# Altium schematic sheet STM32G0B1CEU6.SchDoc
size A3; Revision: 10
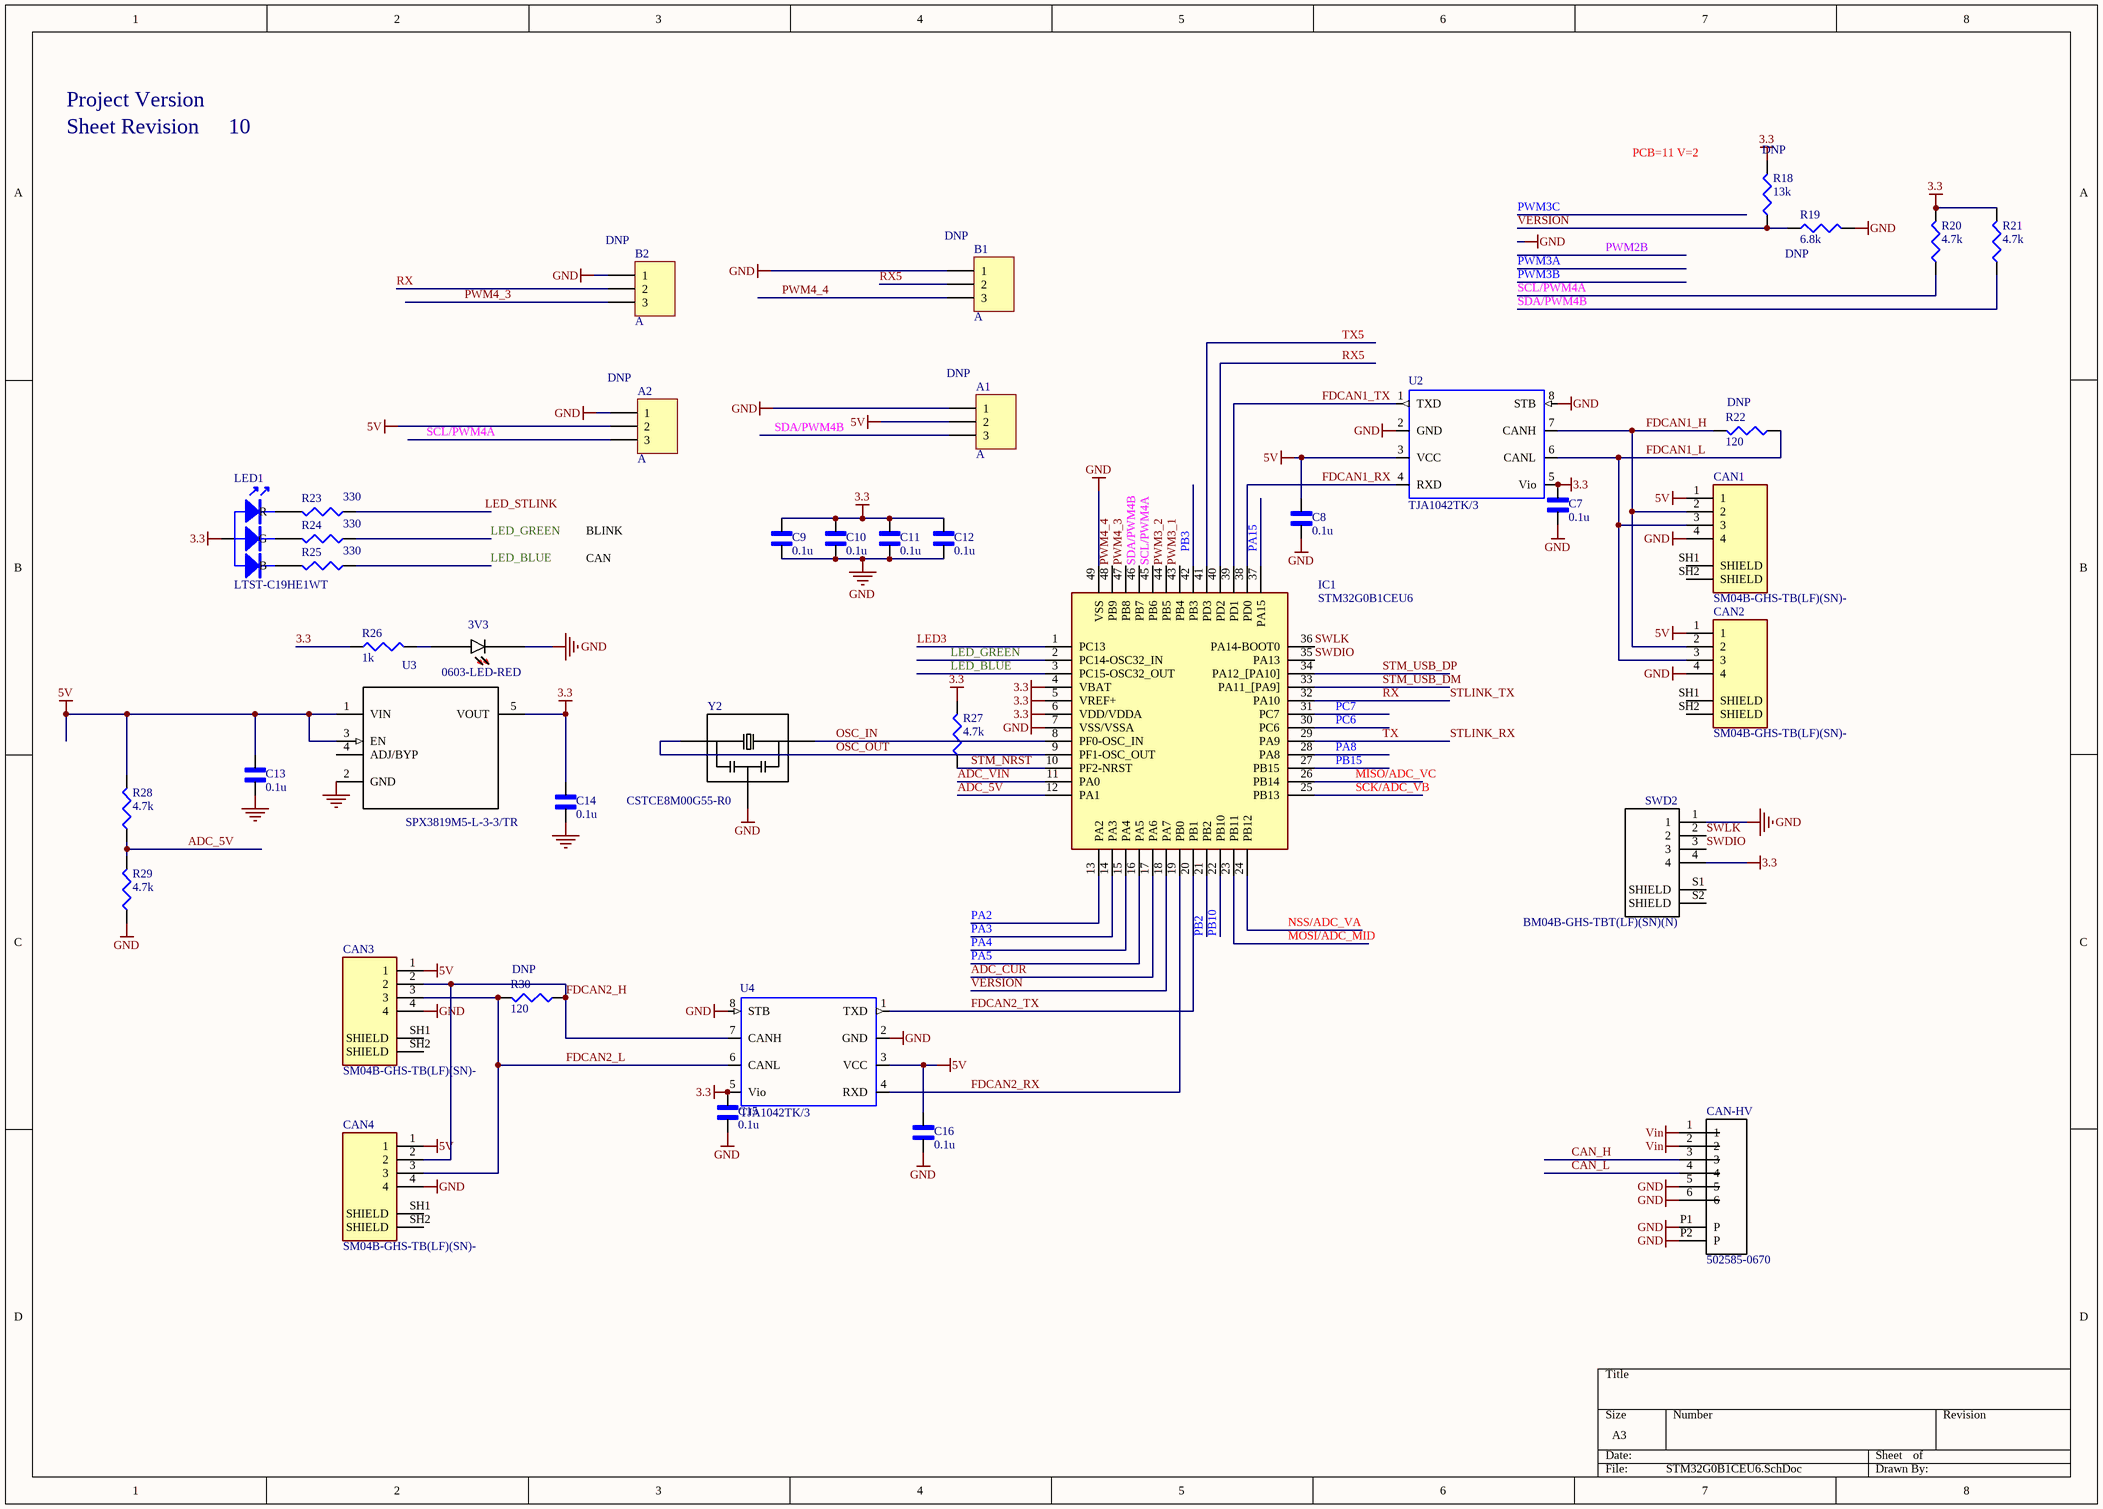
[diagram p0: STM32G0B1CEU6.SchDoc]

## Parts
3V3  0603-LED-RED  [*LEDM1608X80_LTE-C1906R-14(Primary)]
A1  A  Instructions: DNP  [HDR Side 3 pin]
A2  A  Instructions: DNP  [HDR Side 3 pin]
B1  A  Instructions: DNP  [HDR Side 3 pin]
B2  A  Instructions: DNP  [HDR Side 3 pin]
C7  value 0.1u  [CAPC1005X55N]  (hidden comment: GCM155R71H104KE02D)
C8  value 0.1u  [CAPC1005X55N]  (hidden comment: GCM155R71H104KE02D)
C9  value 0.1u  [CAPC1005X55N]  (hidden comment: GCM155R71H104KE02D)
C10  value 0.1u  [CAPC1005X55N]  (hidden comment: GCM155R71H104KE02D)
C11  value 0.1u  [CAPC1005X55N]  (hidden comment: GCM155R71H104KE02D)
C12  value 0.1u  [CAPC1005X55N]  (hidden comment: GCM155R71H104KE02D)
C13  value 0.1u  [CAPC1005X55N]  (hidden comment: GCM155R71H104KE02D)
C14  value 0.1u  [CAPC1005X55N]  (hidden comment: GCM155R71H104KE02D)
C15  value 0.1u  [CAPC1005X55N]  (hidden comment: GCM155R71H104KE02D)
C16  value 0.1u  [CAPC1005X55N]  (hidden comment: GCM155R71H104KE02D)
CAN1  SM04B-GHS-TB(LF)(SN)-  [JST_SM04B-GHS-TB(LF)(SN)-]
CAN2  SM04B-GHS-TB(LF)(SN)-  [JST_SM04B-GHS-TB(LF)(SN)-]
CAN3  SM04B-GHS-TB(LF)(SN)-  [JST_SM04B-GHS-TB(LF)(SN)-]
CAN4  SM04B-GHS-TB(LF)(SN)-  [JST_SM04B-GHS-TB(LF)(SN)-]
CAN-HV  502585-0670  [MOLEX_502585-0670]
IC1  STM32G0B1CEU6  [QFN50P700X700X60-49N-D]
LED1  LTST-C19HE1WT  [LTST-C19HE1WT]
R18  value 13k  Instructions: DNP  [RESC1005X40N]  (hidden comment: RC0402FR-0713KL)
R19  value 6.8k  Instructions: DNP  [RESC1005X40N]  (hidden comment: RC0402FR-076K8L)
R20  value 4.7k  [RESC1005X40N]  (hidden comment: RC0402FR-074K7L)
R21  value 4.7k  [RESC1005X40N]  (hidden comment: RC0402FR-074K7L)
R22  value 120  Instructions: DNP  [J1-0603]  (hidden comment: Res3)
R23  value 330  [RESC1005X40N]  (hidden comment: RC0402FR-07330RL)
R24  value 330  [RESC1005X40N]  (hidden comment: RC0402FR-07330RL)
R25  value 330  [RESC1005X40N]  (hidden comment: RC0402FR-07330RL)
R26  value 1k  [RESC1005X40N]  (hidden comment: RC0402FR-071KL)
R27  value 4.7k  [RESC1005X40N]  (hidden comment: RC0402FR-074K7L)
R28  value 4.7k  [RESC1005X40N]  (hidden comment: RC0402FR-074K7L)
R29  value 4.7k  [RESC1005X40N]  (hidden comment: RC0402FR-074K7L)
R30  value 120  Instructions: DNP  [J1-0603]  (hidden comment: Res3)
SWD2  BM04B-GHS-TBT(LF)(SN)(N)  [JST_BM04B-GHS-holes]
U2  TJA1042TK/3  [SOT782-1]
U3  SPX3819M5-L-3-3/TR  [*SOT95P280X145-5N]
U4  TJA1042TK/3  [SOT782-1]
Y2  CSTCE8M00G55-R0  [*OSC_CSTCE8M00G55-R0]

## Nets
3.3: C7.2 C9.2 C10.2 C11.2 C12.2 C14.2 C15.2 IC1.4(VBAT) IC1.5(VREF+) IC1.6(VDD/VDDA) LED1.4(A) R18.2 R20.2 R21.2 R26.1 R27.2 SWD2.4 U2.5(Vio) U3.5(VOUT) U4.5(Vio)
5V: A1.2 A2.2 C8.2 C13.2 C16.2 CAN1.1 CAN2.1 CAN3.1 CAN4.1 R28.2 U2.3(VCC) U3.1(VIN) U3.3(EN) U4.3(VCC)
GND: 3V3.C A1.1 A2.1 B1.1 B2.1 C7.1 C8.1 C9.1 C10.1 C11.1 C12.1 C13.1 C14.1 C15.1 C16.1 CAN1.4 CAN2.4 CAN3.4 CAN4.4 CAN-HV.5 CAN-HV.6 CAN-HV.P1(P) CAN-HV.P2(P) IC1.7(VSS/VSSA) IC1.49(VSS) R19.2 R29.1 SWD2.1 U2.2(GND) U2.8(STB) U3.2(GND) U4.2(GND) U4.8(STB) Y2.2
Vin: CAN-HV.1 CAN-HV.2
ADC_5V: IC1.12(PA1) R28.1 R29.2
ADC_CUR: IC1.17(PA6)
ADC_VIN: IC1.11(PA0)
CAN_H: CAN-HV.3
CAN_L: CAN-HV.4
FDCAN1_H: CAN1.2 CAN2.2 R22.2 U2.7(CANH)
FDCAN1_L: CAN1.3 CAN2.3 R22.1 U2.6(CANL)
FDCAN1_RX: IC1.38(PD0) U2.4(RXD)
FDCAN1_TX: IC1.39(PD1) U2.1(TXD)
FDCAN2_H: CAN3.2 CAN4.2 R30.1 U4.7(CANH)
FDCAN2_L: CAN3.3 CAN4.3 R30.2 U4.6(CANL)
FDCAN2_RX: IC1.19(PB0) U4.4(RXD)
FDCAN2_TX: IC1.20(PB1) U4.1(TXD)
LED3: IC1.1(PC13)
LED_BLUE: IC1.3(PC15-OSC32_OUT) R25.1
LED_GREEN: IC1.2(PC14-OSC32_IN) R24.1
LED_STLINK: R23.1
MISO/ADC_VC: IC1.26(PB14)
MOSI/ADC_MID: IC1.23(PB11)
NSS/ADC_VA: IC1.24(PB12)
OSC_IN: IC1.8(PF0-OSC_IN) Y2.3
OSC_OUT: IC1.9(PF1-OSC_OUT) Y2.1
PA2: IC1.13(PA2)
PA3: IC1.14(PA3)
PA4: IC1.15(PA4)
PA5: IC1.16(PA5)
PA8: IC1.28(PA8)
PA15: IC1.37(PA15)
PB2: IC1.21(PB2)
PB3: IC1.42(PB3)
PB10: IC1.22(PB10)
PB15: IC1.27(PB15)
PC6: IC1.30(PC6)
PC7: IC1.31(PC7)
PWM3_1: IC1.43(PB4)
PWM3_2: IC1.44(PB5)
PWM4_3: B2.3 IC1.47(PB8)
PWM4_4: B1.3 IC1.48(PB9)
RX: B2.2 IC1.32(PA10)  [also labelled STLINK_TX]
RX5: B1.2 IC1.40(PD2)
SCK/ADC_VB: IC1.25(PB13)
SCL/PWM4A: A2.3 IC1.45(PB6) R20.1
SDA/PWM4B: A1.3 IC1.46(PB7) R21.1
STLINK_RX: IC1.29(PA9)  [also labelled TX]
STM_NRST: IC1.10(PF2-NRST) R27.1
STM_USB_DM: IC1.33(PA11_[PA9])
STM_USB_DP: IC1.34(PA12_[PA10])
SWDIO: IC1.35(PA13) SWD2.3
SWLK: IC1.36(PA14-BOOT0) SWD2.2
TX5: IC1.41(PD3)
VERSION: IC1.18(PA7) R18.1 R19.1
Net3V3_A: 3V3.A R26.2
NetLED1_1: LED1.1(R) R23.2
NetLED1_2: LED1.2(G) R24.2
NetLED1_3: LED1.3(B) R25.2

Not connected (* = marked no-connect by the designer): CAN1 SH1(SHIELD) SH2(SHIELD); CAN2 SH1(SHIELD) SH2(SHIELD); CAN3 SH1(SHIELD) SH2(SHIELD); CAN4 SH1(SHIELD) SH2(SHIELD); SWD2 S1(SHIELD) S2(SHIELD); U3 4(ADJ/BYP)

## Notes on the sheet
- Project Version
- Sheet Revision
- PCB=11 V=2
- CAN
- BLINK

## Library data of the parts
3V3 = 0603-LED-RED: Red 620nm LED Indication - Discrete 2.2V 0603 (1608 Metric); MP: LTST-C194KRKT; Package: 0603 Lite-On; SnapEDA_Link: https://www.snapeda.com/parts/LTE-C1906R-14/Lite-On%20Inc./view-part/?ref=snap; Value: RED; Type: SMD
A1 A2 B1 B2 = Header 3: Header, 3-Pin; System: Connector; MF: Connfly electronic (Zhenqin); MP: PLS-3 (DS1021-1x3); Type: SMD; ChipDip_Link: https://www.chipdip.ru/product/pls-3; HelpURL: https://static.chipdip.ru/lib/227/DOC000227157.pdf
C7-C16 = GCM155R71H104KE02D: GCM155R71H104KE02D, Чип 0402 X7R 0.1uF +10% 50V,Конденсатор; MF: Murata; SnapEDA_Link: https://www.snapeda.com/parts/GCM155R71H104KE02D/Murata%20Electronics%20North%20America/view-part/597463/?ref=snap; Package: 0402; MP: GCM155R71H104KE02D; ChipDip_Link: https://www.chipdip.ru/product/gcm155r71h104ke02d-murata
CAN1 CAN2 = SM04B-GHS-TB(LF)(SN)-: Connector Header Surface Mount, Right Angle 4 position 0.049 _1.25mm_; MF: JST Sales; MP: SM04B-GHS-TB(LF)(SN); Package: None; Value: *; SnapEDA_Link: https://www.snapeda.com/parts/SM04B-GHS-TB%28LF%29%28SN%29-/JST%20Sales%20America%20Inc./view-part/2759740/?ref=snap; HelpURL: http://www.farnell.com/datasheets/2082975.pdf; System: Connector; ChipDip_Link: https://www.chipdip.ru/product/sm04b-ghs-tb-lf-sn-gh-1.25mm-header-side-ent
CAN3 CAN4 = SM04B-GHS-TB(LF)(SN)-: Connector Header Surface Mount, Right Angle 4 position 0.049 _1.25mm_; MF: JST Sales; Instructions: DNP; MP: SM04B-GHS-TB(LF)(SN); Package: None; Value: *; SnapEDA_Link: https://www.snapeda.com/parts/SM04B-GHS-TB%28LF%29%28SN%29-/JST%20Sales%20America%20Inc./view-part/2759740/?ref=snap; HelpURL: http://www.farnell.com/datasheets/2082975.pdf; System: Connector; ChipDip_Link: https://www.chipdip.ru/product/sm04b-ghs-tb-lf-sn-gh-1.25mm-header-side-ent
CAN-HV = 502585-0670: 1.50mm Pitch, CLIK-Mate PCB Receptacle, Single Row, Surface Mount, Right-Angle, Tin Plating, Positive Lock, 6 Circuits, Natural; MF: Molex; System: Connector; MP: 502585-0670; Package: None; SnapEDA_Link: https://www.snapeda.com/parts/502494-0670/Molex/view-part/?ref=snap; Value: *; Type: SMD
IC1 = STM32G0B1CxU6: Integrated Circuit; MF: STMicroelectronics; Datasheet Link: https://www.arrow.com/en/products/stm32g0b1ccu6/stmicroelectronics; Height: 0.6mm; MP: STM32G0B1CEU6; Mouser Part Number: 511-STM32G0B1CEU6; Mouser Price/Stock: https://www.mouser.co.uk/ProductDetail/STMicroelectronics/STM32G0B1CCU6?qs=pUKx8fyJudC4OyO6dw1N1A%3D%3D; Arrow Part Number: STM32G0B1CEU6; Arrow Price/Stock: https://www.arrow.com/en/products/stm32g0b1ccu6/stmicroelectronics
LED1 = RGB_LED_5MM: Blue/Green/Red; ChipDip_Link: https://www.chipdip.ru/product1/8003387462; HelpURL: https://static.chipdip.ru/lib/039/DOC013039662.pdf; MP: LTST-C19HE1WT
R18 = RC0402FR-0713KL: 0.062Вт 0402 13 кОм, 1%, Чип резистор (SMD); Pacage Metric: 1005; MF: Yageo or NXP; ChipDip_Link: https://www.chipdip.ru/product0/9000189640; HelpURL: https://www.chipdip.ru/product0/9000189640; Package: RC0402; Type: SMD; MP: RC0402FR-0713KL; SnapEDA_Link: https://www.snapeda.com/parts/CRGCQ0402F10K/TE%20Connectivity/view-part/3186991/?ref=search&t=0402%2010k
R19 = RC0402FR-076K8L: 0.062Вт 0402 6.8 кОм, 1%, Чип резистор (SMD); Pacage Metric: 1005; MF: Yageo or NXP; ChipDip_Link: https://www.chipdip.ru/product0/9000189640; HelpURL: https://www.chipdip.ru/product0/9000189640; Package: RC0402; Type: SMD; MP: RC0402FR-076K8L; SnapEDA_Link: https://www.snapeda.com/parts/CRGCQ0402F10K/TE%20Connectivity/view-part/3186991/?ref=search&t=0402%2010k
R20 R21 R28 R29 = RC0402FR-074K7L: 0.062Вт 0402 4.7 кОм, 1%, Чип резистор (SMD); Pacage Metric: 1005; MF: Yageo or NXP; ChipDip_Link: https://www.chipdip.ru/product0/9000189640; HelpURL: https://www.chipdip.ru/product0/9000189640; Package: RC0402; Type: SMD; MP: RC0402FR-074K7L; SnapEDA_Link: https://www.snapeda.com/parts/CRGCQ0402F10K/TE%20Connectivity/view-part/3186991/?ref=search&t=0402%2010k
R22 R30 = Res3: 120 Ohms 1 0.1 W 1 10 W Chip Resistor 0603 1608 Metric Thick Film; Pacage Metric: 1608; MP: RC0603FR-07120RL; ChipDip_Link: https://www.chipdip.ru/product0/9000079618; HelpURL: https://www.chipdip.ru/product0/9000079618; Package: R0603; Type: SMD
R23-R25 = RC0402FR-07330RL: 0.062Вт 0402 330 Ом, 1%, Чип резистор (SMD); Pacage Metric: 1005; MF: Yageo or NXP; ChipDip_Link: https://www.chipdip.ru/product0/9000189640; HelpURL: https://www.chipdip.ru/product0/9000189640; Package: RC0402; Type: SMD; MP: RC0402FR-07330RL; SnapEDA_Link: https://www.snapeda.com/parts/CRGCQ0402F10K/TE%20Connectivity/view-part/3186991/?ref=search&t=0402%2010k
R26 = RC0402FR-071KL: 0.062Вт 0402 1 кОм, 1%, Чип резистор (SMD); MF: Yageo or NXP; ChipDip_Link: https://www.chipdip.ru/product0/9000189640; HelpURL: https://www.chipdip.ru/product0/9000189640; Package: RC0402; Type: SMD; MP: RC0402FR-071KL; SnapEDA_Link: https://www.snapeda.com/parts/CRGCQ0402F10K/TE%20Connectivity/view-part/3186991/?ref=search&t=0402%2010k
R27 = RC0402FR-074K7L: 0.062Вт 0402 4.7 кОм, 1%, Чип резистор (SMD); MF: Yageo or NXP; ChipDip_Link: https://www.chipdip.ru/product0/9000189640; HelpURL: https://www.chipdip.ru/product0/9000189640; Package: RC0402; Type: SMD; MP: RC0402FR-074K7L; SnapEDA_Link: https://www.snapeda.com/parts/CRGCQ0402F10K/TE%20Connectivity/view-part/3186991/?ref=search&t=0402%2010k
SWD2 = BM04B-GHS-TBT(LF)(SN)(N): Conn Shrouded Header HDR 4 POS 1.25mm Solder ST SMD Reel; MF: JST Sales; MP: SM04B-GHS-TB(LF)(SN); Instructions: DNP; System: Connector; SnapEDA_Link: https://www.snapeda.com/parts/BM04B-GHS-TBT%28LF%29%28SN%29%28N%29/JST%20Sales%20America%20Inc./view-part/?ref=snap; Package: None; Value: *; Type: SMD
U2 U4 = TJA1042TK/3: 1/1 Transceiver Half CANbus 8-SO; MF: NXP USA; SnapEDA_Link: https://www.snapeda.com/parts/TJA1042/NXP%20USA%20Inc./view-part/900919/?ref=snap; Value: *; MP: TJA1042TK/3; Package: VDFN-8 NXP USA; ChipDip_Link: https://www.chipdip.ru/product1/8002988465; HelpURL: https://static.chipdip.ru/lib/583/DOC001583059.pdf; Type: SMD
U3 = SPX3819M5-L: Low Dropout Voltage Regulator, Adjustable 0.5A, В±1%, 2.5 to 16 Vin, 5-Pin SOT-23; MF: MaxLinear, Inc.; Value: 3V3; MP: SPX3819M5-L-3-3/TR; Package: SOT-23-5 Exar; SnapEDA_Link: https://www.snapeda.com/parts/SPX3819M5-L/MaxLinear%2C%20Inc./view-part/?ref=snap; Type: SMD; ChipDip_Link: https://www.chipdip.ru/product1/8003455237; HelpURL: http://www.farnell.com/datasheets/2614478.pdf
Y2 = CSTCE8M00G55-R0: Ceramic Resonator 8MHz ??0.5% _Tol_ ??0.2% _Stability_ 33pF 40Ohm 3-Pin CSMD T/R; MP: CSTCE8M00G55-R0 or CSTCE8M00G52-R0; MF: Murata; Package: SMD-3 Murata; SnapEDA_Link: https://www.snapeda.com/parts/CSTCE8M00G55-R0/Murata%20Electronics%20North%20America/view-part/?ref=snap; Value: 8MHz; ChipDip_Link: https://www.chipdip.ru/product1/8001783721; HelpURL: https://www.murata.com/en-eu/api/pdfdownloadapi?cate=&partno=CSTCE8M00G55-R0; Type: SMD